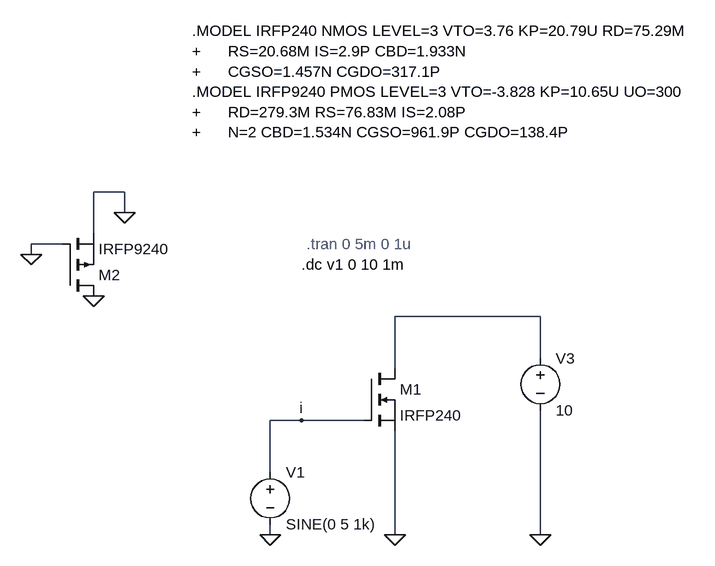
[diagram p0: schematic mosfetb.asc]
mosfetb.asc, the LTspice schematic file:
Version 4
SHEET 1 1384 680
WIRE -272 -352 -320 -352
WIRE -272 -320 -272 -352
WIRE -320 -288 -320 -352
WIRE -368 -272 -416 -272
WIRE -416 -256 -416 -272
WIRE 368 -160 144 -160
WIRE 368 -96 368 -160
WIRE 144 -80 144 -160
WIRE 0 0 -48 0
WIRE 96 0 0 0
WIRE -48 80 -48 0
WIRE -48 176 -48 160
WIRE 144 176 144 16
WIRE 368 176 368 -16
FLAG -48 176 0
FLAG 0 0 i
FLAG -320 -192 0
FLAG -416 -256 0
FLAG -272 -320 0
FLAG 144 176 0
FLAG 368 176 0
SYMBOL voltage -48 64 R0
WINDOW 123 0 0 Left 0
WINDOW 39 0 0 Left 0
SYMATTR InstName V1
SYMATTR Value SINE(0 5 1k)
SYMBOL voltage 368 -112 R0
WINDOW 123 0 0 Left 0
WINDOW 39 0 0 Left 0
SYMATTR InstName V3
SYMATTR Value 10
SYMBOL nmos 96 -80 R0
SYMATTR InstName M1
SYMATTR Value IRFP240
SYMBOL pmos -368 -192 M180
SYMATTR InstName M2
SYMATTR Value IRFP9240
TEXT 0 -240 Left 2 !.dc v1 0 10 1m
TEXT 8 -272 Left 2 ;.tran 0 5m 0 1u
TEXT -168 -600 Left 2 !.MODEL IRFP240 NMOS LEVEL=3 VTO=3.76 KP=20.79U RD=75.29M \n+      RS=20.68M IS=2.9P CBD=1.933N \n+      CGSO=1.457N CGDO=317.1P\n.MODEL IRFP9240 PMOS LEVEL=3 VTO=-3.828 KP=10.65U UO=300 \n+      RD=279.3M RS=76.83M IS=2.08P \n+      N=2 CBD=1.534N CGSO=961.9P CGDO=138.4P

The netlist it stands for:
* mosfetb.asc
V1 i 0 SINE(0 5 1k)
V3 N001 0 10
M1 N001 i 0 0 IRFP240
M2 0 0 0 0 IRFP9240
.model NMOS NMOS
.model PMOS PMOS
.lib standard.mos
.dc v1 0 10 1m
* .tran 0 5m 0 1u
.MODEL IRFP240 NMOS LEVEL=3 VTO=3.76 KP=20.79U RD=75.29M
+      RS=20.68M IS=2.9P CBD=1.933N
+      CGSO=1.457N CGDO=317.1P
.MODEL IRFP9240 PMOS LEVEL=3 VTO=-3.828 KP=10.65U UO=300
+      RD=279.3M RS=76.83M IS=2.08P
+      N=2 CBD=1.534N CGSO=961.9P CGDO=138.4P
.backanno
.end